# EAGLE design Statemachine_ST7735.R02 (EAGLE 6.5.0)
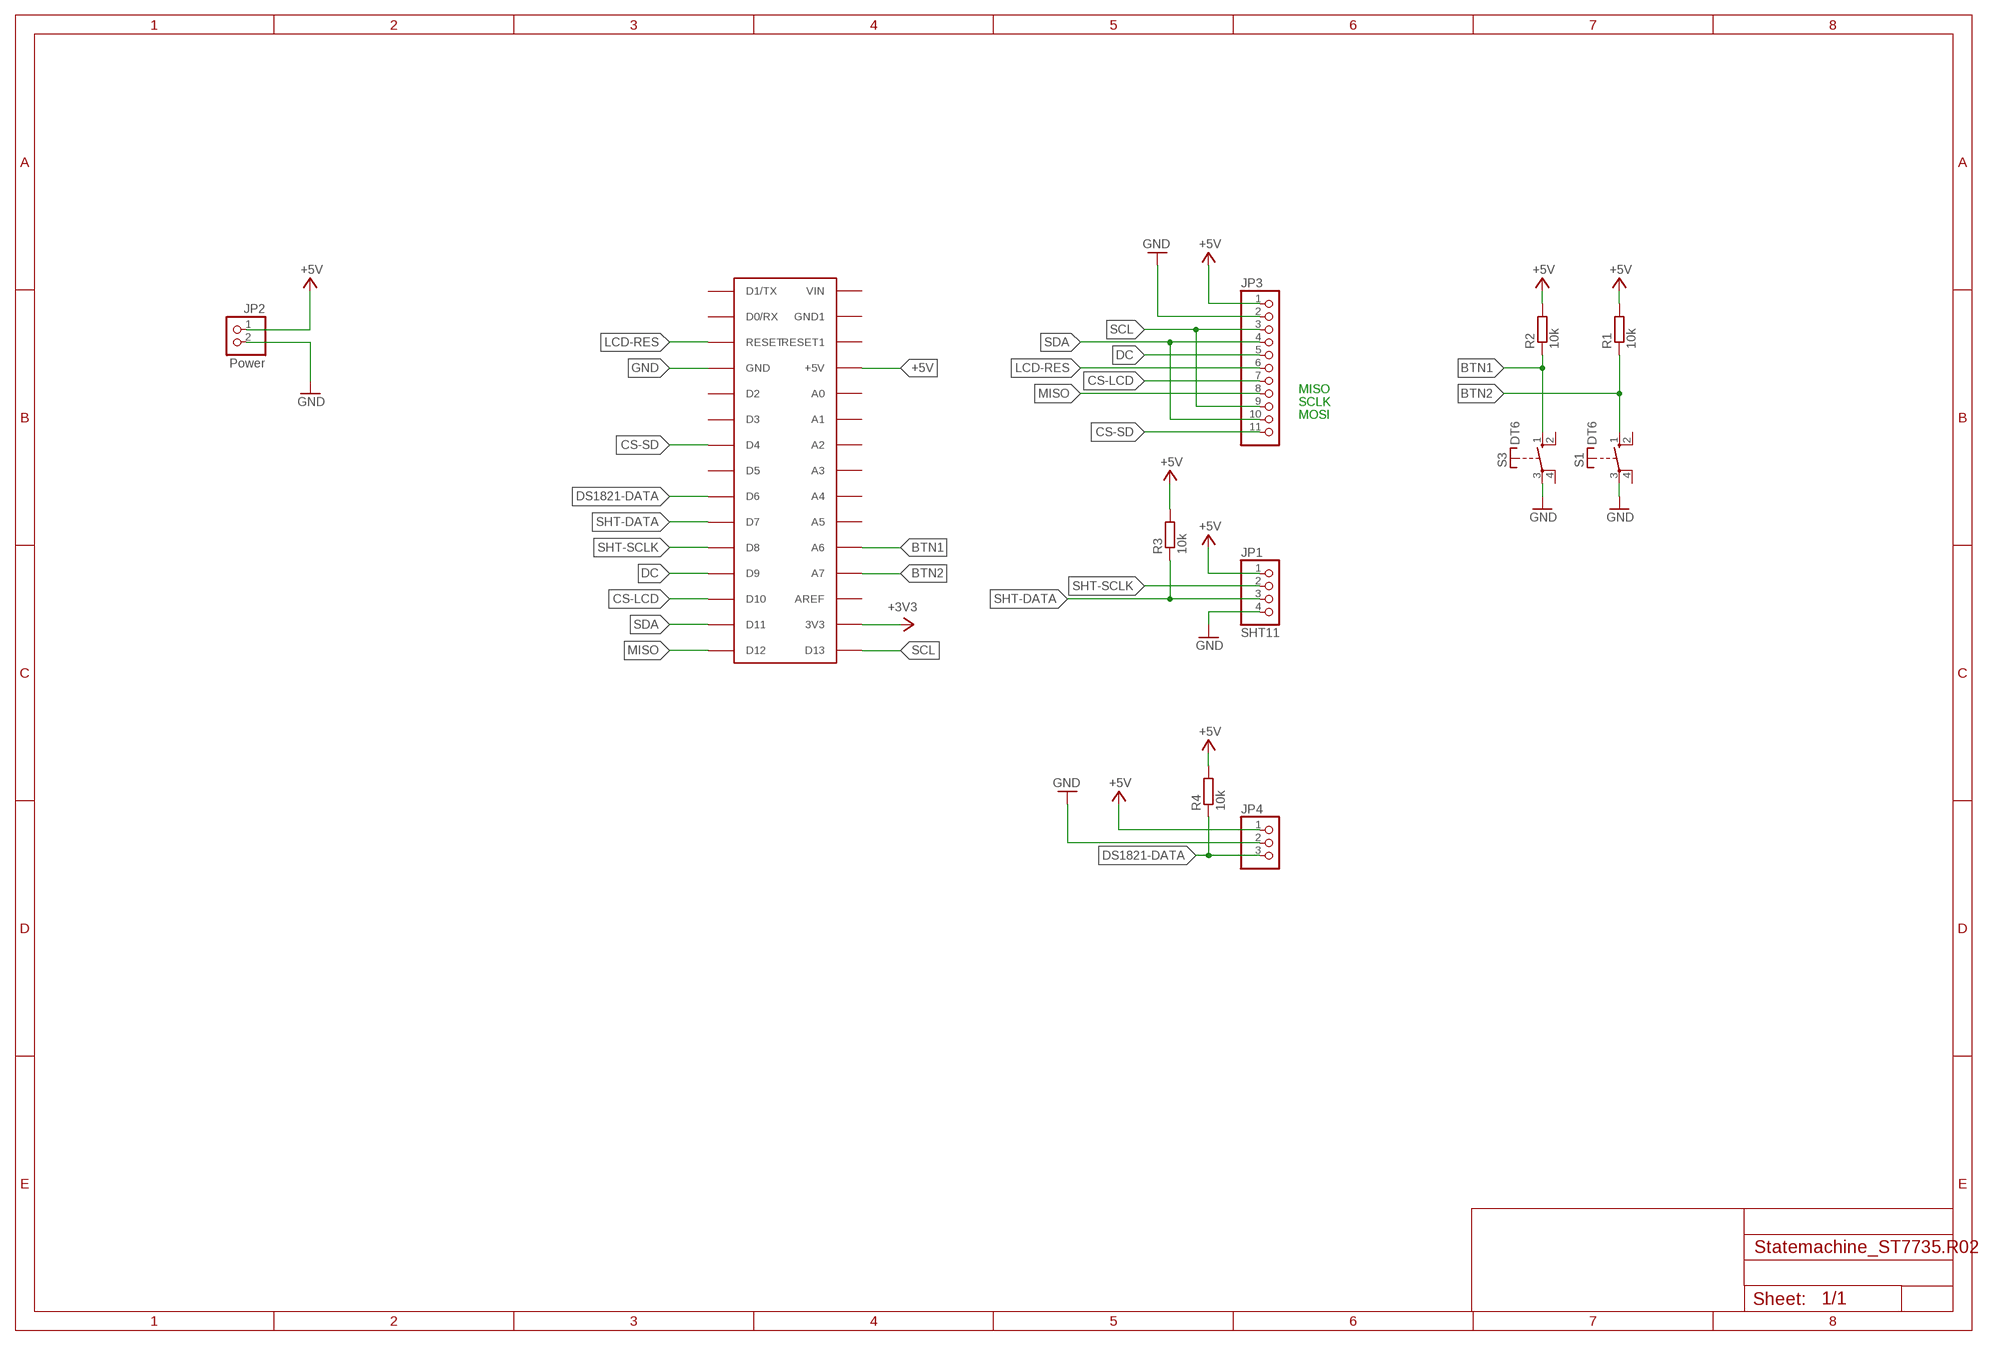
[diagram p0: schematic, sheet 1]

## Parts
JP1  SHT11  PINHD-1X4  [1X04]
JP2  Power  PINHD-1X2  [1X02]
JP3  PINHD-1X11  [1X11]
JP4  PINHD-1X3  [1X03]
R1  10k  R-EU_0204/7  [0204/7]
R2  10k  R-EU_0204/7  [0204/7]
R3  10k  R-EU_0204/7  [0204/7]
R4  10k  R-EU_0204/7  [0204/7]
S1  DT6  [DT6]
S3  DT6  [DT6]
U$1  ARDUINONANO  [PDIP-32]

## Nets
+3V3: U$1.3V3
+5V: JP1.1 JP2.1 JP3.1 JP4.1 R1.2 R2.2 R3.2 R4.2 U$1.+5V
BTN1: R2.1 S3.1(S) U$1.A6
BTN2: R1.1 S1.1(S) U$1.A7
CS-LCD: JP3.7 U$1.D10
CS-SD: JP3.11 U$1.D4
DC: JP3.5 U$1.D9
DS1821-DATA: JP4.3 R4.1 U$1.D6
GND: JP1.4 JP2.2 JP3.2 JP4.2 S1.3(P) S3.3(P) U$1.GND
LCD-RES: JP3.6 U$1.RESET
MISO: JP3.8 U$1.D12
SCL: JP3.3 JP3.9 U$1.D13
SDA: JP3.4 JP3.10 U$1.D11
SHT-DATA: JP1.3 R3.1 U$1.D7
SHT-SCLK: JP1.2 U$1.D8
Unconnected: S1.2(S) S1.4(P) S3.2(S) S3.4(P) U$1.A0 U$1.A1 U$1.A2 U$1.A3 U$1.A4 U$1.A5 U$1.AREF U$1.D0/RX U$1.D1/TX U$1.D2 U$1.D3 U$1.D5 U$1.GND1 U$1.RESET1 U$1.VIN

## Notes on the sheet
- MISO
- SCLK
- MOSI

## Library data of the parts
JP1 = pinhead:PINHD-1X4: PIN HEADER
JP2 = pinhead:PINHD-1X2: PIN HEADER
JP3 = pinhead:PINHD-1X11: PIN HEADER
JP4 = pinhead:PINHD-1X3: PIN HEADER
R1-R4 = resistor:R-EU_: RESISTOR, European symbol
S1 S3 = switch-misc:DT: ITT SWITCH
U$1 = arduino:ARDUINONANO

## Board
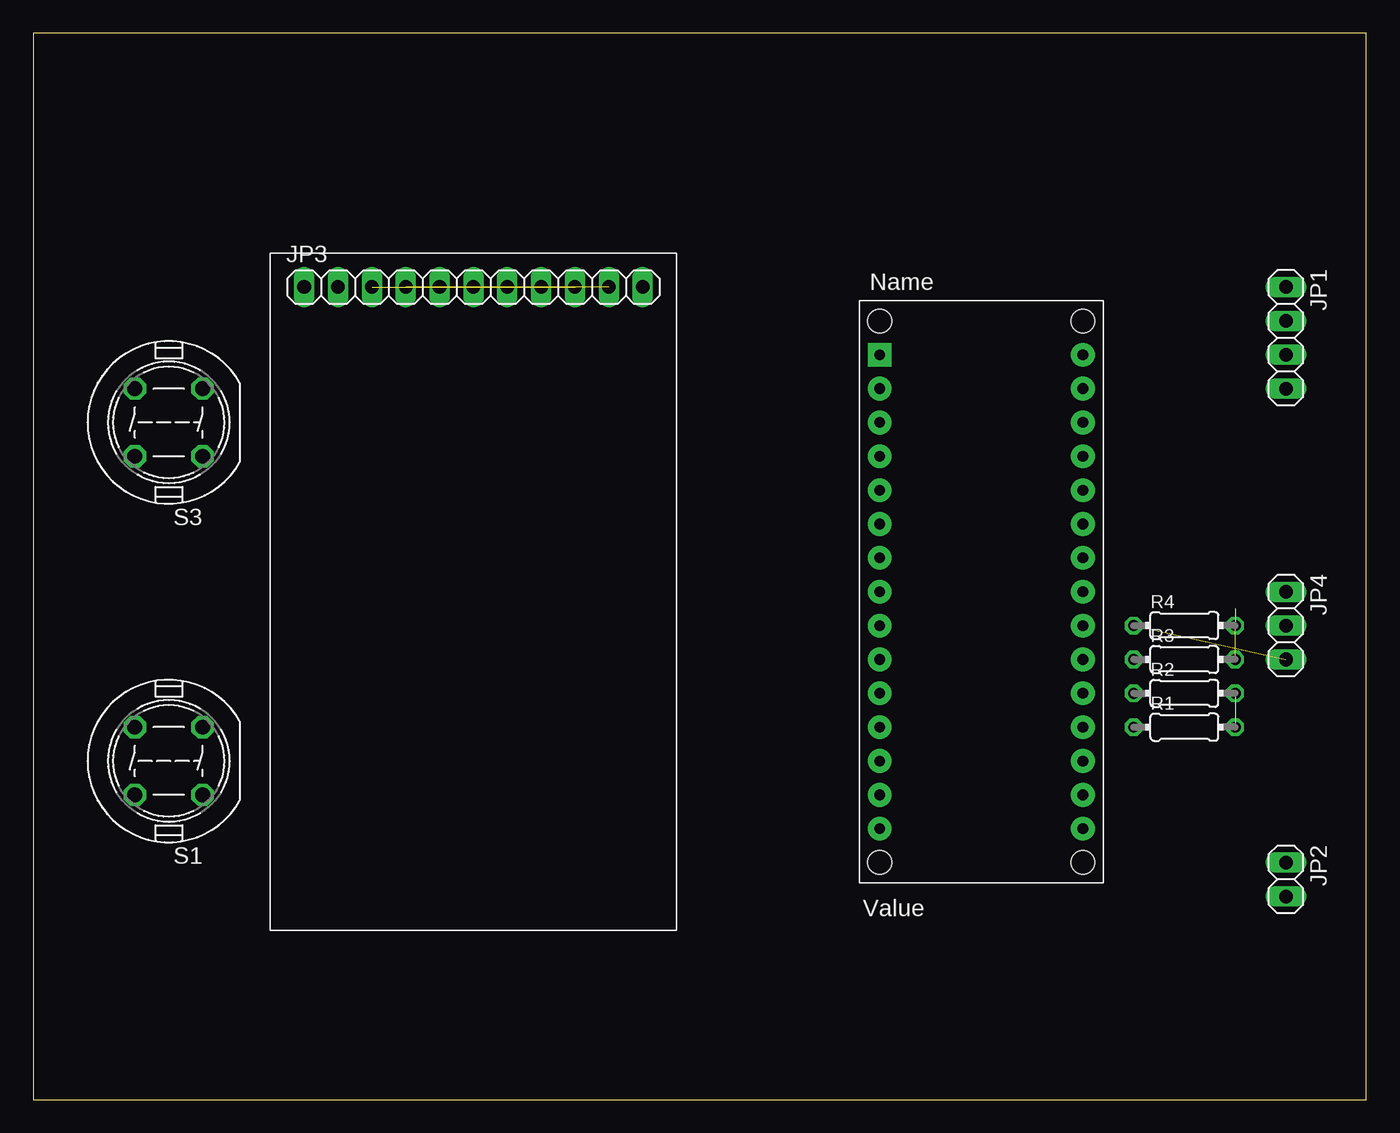
[diagram p1: board, top side]
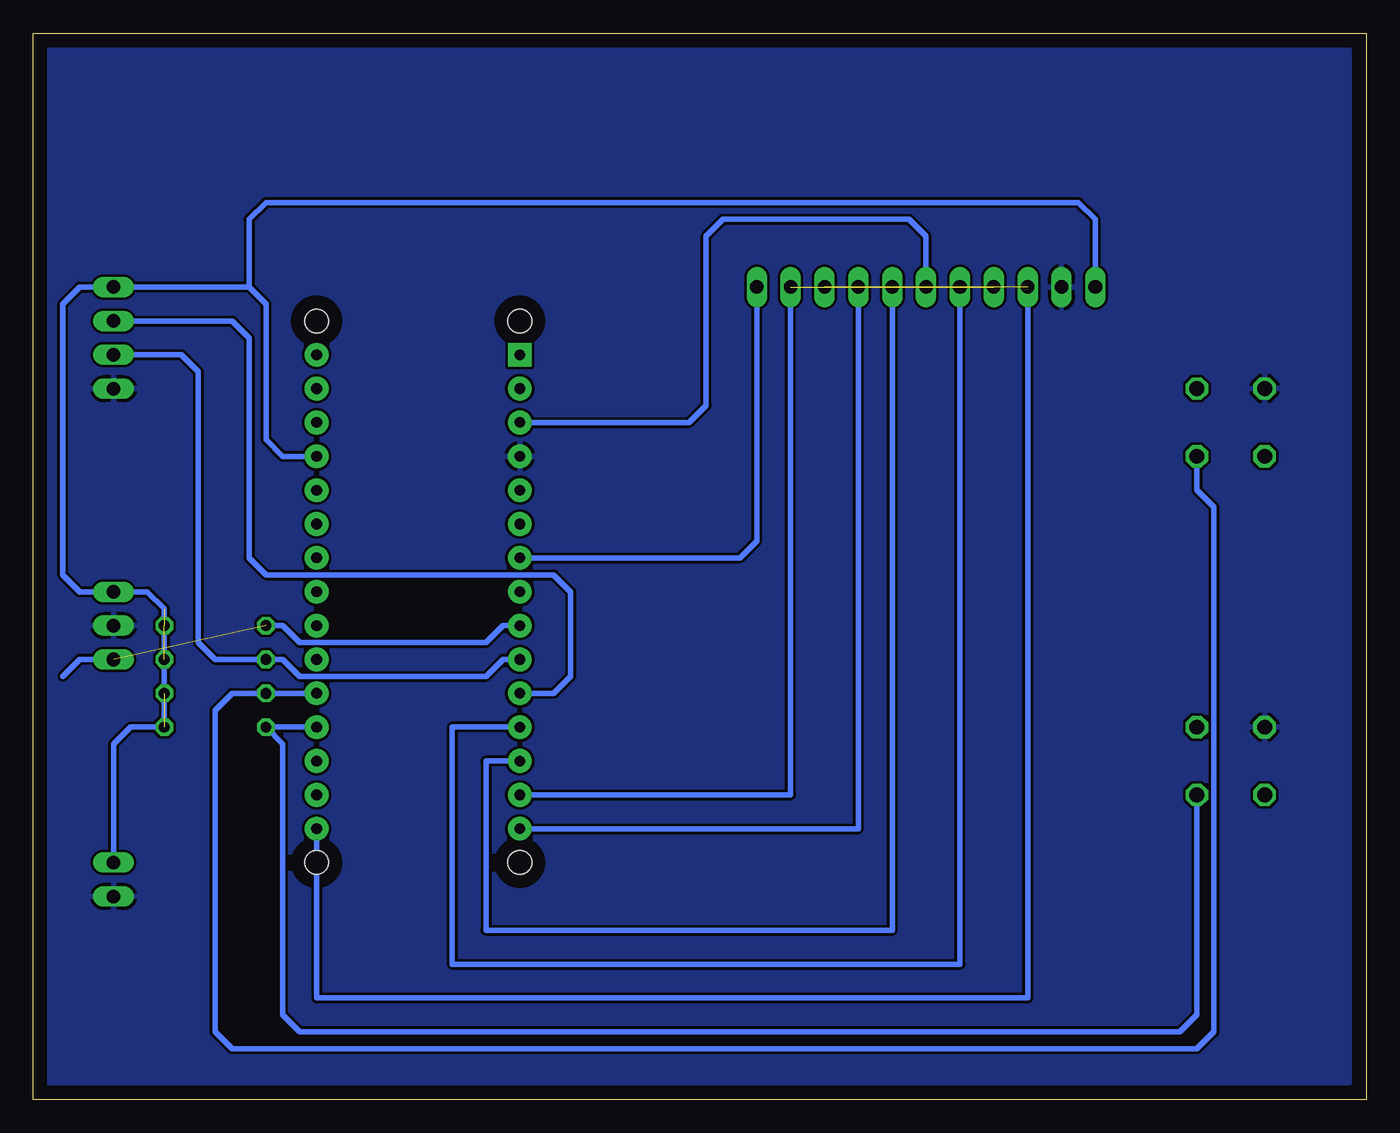
[diagram p2: board, bottom side, seen from below]

Size 100 x 80 mm. Coordinates in mm from the lower left corner, seen from the top.
Outline: 0,0 100,0 100,80 0,80 0,0
Copper layers (1*16): Top 0.035mm / dielectric 1.5mm / Bottom 0.035mm
Design rules "default": minimum track width 10mil, minimum drill 24mil, track to track 8mil, track to pad 8mil, pad to pad 8mil, via to via 8mil, smd to smd 8mil, copper to edge 40mil, drill to drill 8mil, minimum pad ring 10mil, minimum via ring 8mil, stop-mask expansion 4mil, vias tented up to drill 0mil, thermal gap 10mil

### Footprints (pad centres in the part's own frame; a part is rotated, then mirrored left to right if it is on the bottom)
1X04 = drill 1.016 long: 1 -3.81,0; 2 -1.27,0; 3 1.27,0; 4 3.81,0
1X02 = drill 1.016 long: 1 -1.27,0; 2 1.27,0
1X11 = drill 1.016 long: 1 -12.7,0; 2 -10.16,0; 3 -7.62,0; 4 -5.08,0; 5 -2.54,0; 6 0,0; 7 2.54,0; 8 5.08,0; 9 7.62,0; 10 10.16,0; 11 12.7,0
1X03 = drill 1.016 long: 1 -2.54,0; 2 0,0; 3 2.54,0
0204/7 = drill 0.813 octagon: 1 -3.81,0; 2 3.81,0
DT6 = drill 1.118 octagon: 1 -2.54,2.54; 2 2.54,2.54; 3 2.54,-2.54; 4 -2.54,-2.54
PDIP-32 = drill 0.8 pad 1.778: 3V3 15.24,-35.56; +5V 15.24,-10.16; A0 15.24,-12.7; A1 15.24,-15.24; A2 15.24,-17.78; A3 15.24,-20.32; A4 15.24,-22.86; A5 15.24,-25.4; A6 15.24,-27.94; A7 15.24,-30.48; AREF 15.24,-33.02; D0/RX 0,-5.08; D2 0,-12.7; D3 0,-15.24; D4 0,-17.78; D5 0,-20.32; D6 0,-22.86; D7 0,-25.4; D8 0,-27.94; D9 0,-30.48; D10 0,-33.02; D11 0,-35.56; D12 0,-38.1; D13 15.24,-38.1; GND 0,-10.16; GND1 15.24,-5.08; RESET 0,-7.62; RESET1 15.24,-7.62; VIN 15.24,-2.54 | drill 0.8 pad 1.778 square: D1/TX 0,-2.54 | hole 1.778: 0,0; 0,-40.64; 15.24,-40.64; 15.24,0

### Placement (x,y rotation side)
JP1  93.98,57.15 270 top
JP2  93.98,16.51 270 top
JP3  33.02,60.96 0 top
JP4  93.98,35.56 270 top
R1  86.36,27.94 0 top
R2  86.36,30.48 0 top
R3  86.36,33.02 0 top
R4  86.36,35.56 0 top
S1  10.16,25.4 180 top
S3  10.16,50.8 180 top
U$1  63.5,58.42 0 top

### Tracks (layer width: path | path; a pad name or v marks a point on that pad's centre or on a via)
+5V  (3 unrouted)
  Bottom 0.406: U$1.+5V 81.28,48.26 82.55,49.53 82.55,59.69 83.82,60.96 | 83.82,60.96 JP1.1 96.52,60.96 97.79,59.69 97.79,39.37 96.52,38.1 JP4.1 91.44,38.1 90.17,36.83 R1.2 92.71,27.94 93.98,26.67 JP2.1 | JP3.1 20.32,66.04 21.59,67.31 82.55,67.31 83.82,66.04 83.82,60.96
BTN1
  Bottom 0.406: U$1.A6 R2.1 85.09,30.48 86.36,29.21 86.36,5.08 85.09,3.81 12.7,3.81 11.43,5.08 11.43,44.45 12.7,45.72 S3.1
BTN2
  Bottom 0.406: U$1.A7 R1.1 81.28,26.67 81.28,6.35 80.01,5.08 13.97,5.08 12.7,6.35 S1.1
CS-LCD
  Bottom 0.406: U$1.D10 66.04,25.4 66.04,12.7 35.56,12.7 JP3.7
CS-SD
  Bottom 0.406: U$1.D4 46.99,40.64 45.72,41.91 JP3.11
DC
  Bottom 0.406: U$1.D9 68.58,27.94 68.58,10.16 30.48,10.16 JP3.5
DS1821-DATA  (1 unrouted)
  Bottom 0.406: R4.1 81.28,35.56 80.01,34.29 66.04,34.29 64.77,35.56 U$1.D6 | JP4.3 96.52,33.02 97.79,31.75
GND
  pour Bottom: 1.27,78.74 99.06,78.74 99.06,50.8 99.06,1.27 1.27,1.27 1.27,77.47
LCD-RES
  Bottom 0.406: U$1.RESET 50.8,50.8 49.53,52.07 49.53,64.77 48.26,66.04 34.29,66.04 33.02,64.77 JP3.6
MISO
  Bottom 0.406: U$1.D12 38.1,20.32 JP3.8
SCL  (1 unrouted)
  Bottom 0.406: U$1.D13 78.74,7.62 25.4,7.62 JP3.3
SDA  (1 unrouted)
  Bottom 0.406: U$1.D11 43.18,22.86 JP3.10
SHT-DATA
  Bottom 0.406: U$1.D7 64.77,33.02 66.04,31.75 80.01,31.75 81.28,33.02 R3.1 86.36,33.02 87.63,34.29 87.63,54.61 88.9,55.88 JP1.3
SHT-SCLK
  Bottom 0.406: JP1.2 85.09,58.42 83.82,57.15 83.82,40.64 82.55,39.37 60.96,39.37 59.69,38.1 59.69,31.75 60.96,30.48 U$1.D8